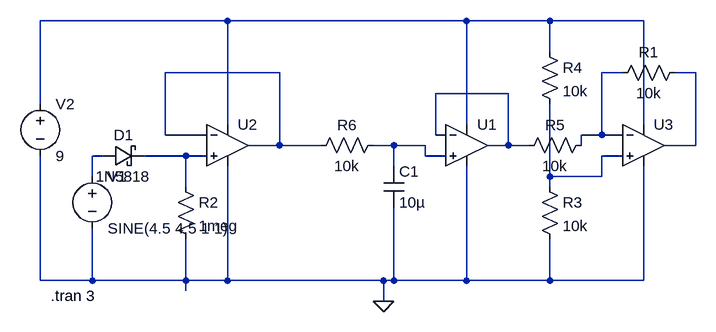
[diagram p0: schematic CVsuming.asc]
CVsuming.asc, the LTspice schematic file:
Version 4
SHEET 1 884 680
WIRE 128 -16 -160 -16
WIRE 496 -16 128 -16
WIRE 624 -16 496 -16
WIRE 768 -16 624 -16
WIRE 624 32 624 -16
WIRE 208 64 32 64
WIRE 736 64 704 64
WIRE 848 64 816 64
WIRE 560 96 448 96
WIRE -160 112 -160 -16
WIRE 128 144 128 -16
WIRE 496 144 496 -16
WIRE 768 144 768 -16
WIRE 32 160 32 64
WIRE 96 160 32 160
WIRE 448 160 448 96
WIRE 464 160 448 160
WIRE 704 160 704 64
WIRE 704 160 672 160
WIRE 736 160 704 160
WIRE 208 176 208 64
WIRE 208 176 160 176
WIRE 272 176 208 176
WIRE 384 176 352 176
WIRE 432 176 384 176
WIRE 560 176 560 96
WIRE 560 176 528 176
WIRE 592 176 560 176
WIRE 672 176 672 160
WIRE 848 176 848 64
WIRE 848 176 800 176
WIRE -64 192 -80 192
WIRE 64 192 0 192
WIRE 96 192 64 192
WIRE 432 192 432 176
WIRE 464 192 432 192
WIRE 736 192 704 192
WIRE 384 208 384 176
WIRE -80 224 -80 192
WIRE 624 224 624 112
WIRE 704 224 704 192
WIRE 704 224 624 224
WIRE 64 240 64 192
WIRE 624 240 624 224
WIRE -160 384 -160 192
WIRE -80 384 -80 304
WIRE -80 384 -160 384
WIRE 64 384 64 320
WIRE 64 384 -80 384
WIRE 128 384 128 208
WIRE 128 384 64 384
WIRE 368 384 128 384
WIRE 384 384 384 272
WIRE 384 384 368 384
WIRE 496 384 496 208
WIRE 496 384 384 384
WIRE 624 384 624 320
WIRE 624 384 496 384
WIRE 768 384 768 208
WIRE 768 384 624 384
WIRE 64 400 64 384
WIRE 368 416 368 384
FLAG 368 416 0
SYMBOL voltage -80 208 R0
WINDOW 123 0 0 Left 2
WINDOW 39 0 0 Left 2
SYMATTR InstName V1
SYMATTR Value SINE(4.5 4.5 1 1)
SYMBOL voltage -160 96 R0
WINDOW 123 0 0 Left 2
WINDOW 39 0 0 Left 2
SYMATTR InstName V2
SYMATTR Value 9
SYMBOL Opamps\\UniversalOpamp2 496 176 R0
SYMATTR InstName U1
SYMBOL res 608 224 R0
SYMATTR InstName R3
SYMATTR Value 10k
SYMBOL res 608 16 R0
SYMATTR InstName R4
SYMATTR Value 10k
SYMBOL schottky -64 208 R270
WINDOW 0 32 32 VTop 2
WINDOW 3 0 32 VBottom 2
SYMATTR InstName D1
SYMATTR Value 1N5818
SYMATTR Description Diode
SYMATTR Type diode
SYMBOL Opamps\\UniversalOpamp2 128 176 R0
SYMATTR InstName U2
SYMBOL Opamps\\UniversalOpamp2 768 176 R0
SYMATTR InstName U3
SYMBOL res 832 48 R90
WINDOW 0 0 56 VBottom 2
WINDOW 3 32 56 VTop 2
SYMATTR InstName R1
SYMATTR Value 10k
SYMBOL res 688 160 R90
WINDOW 0 0 56 VBottom 2
WINDOW 3 32 56 VTop 2
SYMATTR InstName R5
SYMATTR Value 10k
SYMBOL res 48 224 R0
SYMATTR InstName R2
SYMATTR Value 1meg
SYMBOL res 368 160 R90
WINDOW 0 0 56 VBottom 2
WINDOW 3 32 56 VTop 2
SYMATTR InstName R6
SYMATTR Value 10k
SYMBOL cap 368 208 R0
SYMATTR InstName C1
SYMATTR Value 10µ
TEXT -144 408 Left 2 !.tran 3

The netlist it stands for:
* CVsuming.asc
V1 N007 0 SINE(4.5 4.5 1 1)
V2 N001 0 9
XU1 N006 N005 N001 0 N005 level.2 Avol=1Meg GBW=10Meg Slew=10Meg ilimit=25m rail=0 Vos=0 phimargin=45 en=0 enk=0 in=0 ink=0 Rin=500Meg  ; pins IN+ IN- V+ V- OUT
R3 N009 0 10k
R4 N001 N009 10k
D1 N007 N008 1N5818
XU2 N008 N002 N001 0 N002 level.2 Avol=1Meg GBW=10Meg Slew=10Meg ilimit=25m rail=0 Vos=0 phimargin=45 en=0 enk=0 in=0 ink=0 Rin=500Meg  ; pins IN+ IN- V+ V- OUT
XU3 N009 N003 N001 0 N004 level.2 Avol=1Meg GBW=10Meg Slew=10Meg ilimit=25m rail=0 Vos=0 phimargin=45 en=0 enk=0 in=0 ink=0 Rin=500Meg  ; pins IN+ IN- V+ V- OUT
R1 N004 N003 10k
R5 N003 N005 10k
R2 N008 0 1meg
R6 N006 N002 10k
C1 N006 0 10µ
.model D D
.lib standard.dio
.tran 3
.lib UniversalOpamps2.sub
.backanno
.end